# Altium schematic sheet BufferBiasAmp.SchDoc
size A; SheetNumber: 3; SheetTotal: 4
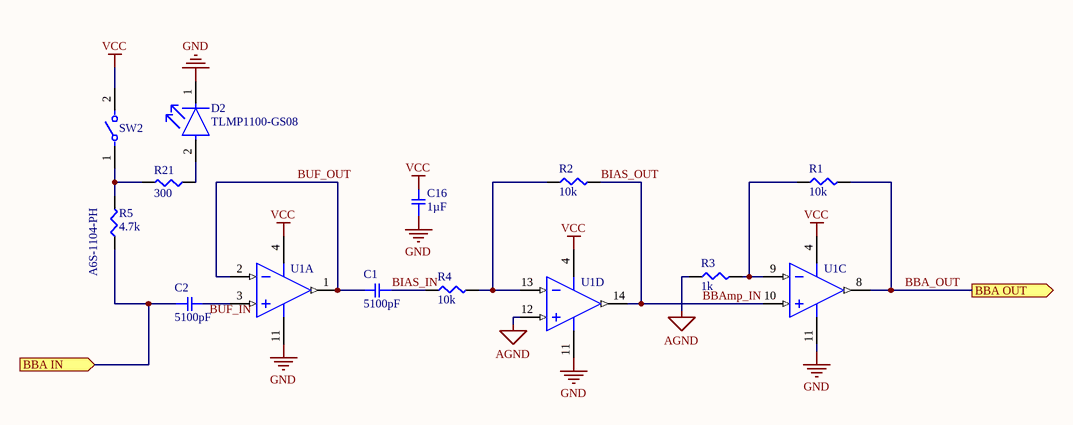
[diagram p0: BufferBiasAmp.SchDoc]

## Parts
C1  5100pF  [SMD-0603C]
C2  5100pF  [SMD-0603C]
C16  1µF  [SMD-0603C]
D2  TLMP1100-GS08  [FP-6_541-5056_01-4-MFG]
R1  10k  [SMD-0603-RES]
R2  10k  [SMD-0603-RES]
R3  1k  [SMD-0603-RES]
R4  10k  [SMD-0603-RES]
R5  4.7k  [SMD-0603-RES]
R21  300  [SMD-0603-RES]
SW2  Switch_Omron_A6S-1104-PH_eec  [Omron_A6S-1104-PH_0]  (value not drawn)
U1  OPA1604AIPWR  [PW0014A_N]  (value not drawn)  (parts A,C,D of 4)

## Ports
BBA IN (in), BBA OUT (out)

## Nets
AGND: R3.1 U1.12(IN_D+)
GND: C16.1 D2.1(C) U1.11(V-)
VCC: C16.2 SW2.2 U1.4(V+)
BBA IN: C2.1 R5.1 ; port BBA IN
BBA_OUT: R1.2 U1.8(OUT_C) ; port BBA OUT
BBAmp_IN: R2.2 U1.10(IN_C+) U1.14(OUT_D)  [also labelled BIAS_OUT]
BIAS_IN: C1.1 R4.1
BUF_OUT: C1.2 U1.1(OUT_A) U1.2(IN_A-)
NetC2_2: C2.2 U1.3(IN_A+)
NetD2_2: D2.2(A) R21.1
NetR1_1: R1.1 R3.2 U1.9(IN_C-)
NetR2_1: R2.1 R4.2 U1.13(IN_D-)
NetR5_2: R5.2 R21.2 SW2.1

## Notes on the sheet
- (near R5) A6S-1104-PH
- Labels drawn without touching a wire or pin: BUF_IN

## Library data of the parts
C1 = GRM1887U1H512JA01D: CAP CER 5100PF 50V U2J 0603; Manufacturer: Murata Electronics North America; Value: 5100pF; Operating Temperature: -55°C ~ 125°C; Package / Case: 0603 (1608 Metric); Datasheet Link: https://www.digikey.com/en/products/detail/murata-electronics/GRM1887U1H512JA01D/2612102; Manufacturer Part Number: GRM1887U1H512JA01D
C2 = GRM1887U1H512JA01D: CAP CER 5100PF 50V U2J 0603; Manufacturer: Murata Electronics North America; Factory Stock: 0; Unit Price (USD): 0.2; Minimum Quantity: 1; Tolerance: ±5%; Datasheets: http://www.murata.com/~/media/webrenewal/support/library/catalog/products/capacitor/mlcc/c02e.pdf; Image: //media.digikey.com/Renders/Murata%20Renders/ZRB-SERIES-0402.jpg; Digi-Key Part Number: 490-6399-1-ND; Part Number: GRM1887U1H512JA01D; Quantity Available: 12288; @ qty: 0; Packaging: Cut Tape (CT); Series: GRM; Part Status: Active; Value: 5100pF; Voltage: 50V; Temperature Coefficient: U2J; Operating Temperature: -55°C ~ 125°C; Features: -; Ratings: -; Applications: General Purpose; Mounting Type: Surface Mount, MLCC; Package / Case: 0603 (1608 Metric); Size / Dimension: 0.063" L x 0.031" W (1.60mm x 0.80mm); Height - Seated (Max): -; Thickness (Max): 0.035" (0.90mm); Lead Spacing: -; Lead Style: -
C16 = GCM188R71C105KA64D: CAP CER 1UF 16V X7R 0603; Manufacturer: Samsung Electro-Mechanics; Manufacturer Part Number: CL10A105KA8NNNC; Value: 1µF; Operating Temperature: -55°C ~ 125°C; Package / Case: 0603 (1608 Metric); Datasheet Link: https://www.digikey.com/en/products/detail/samsung-electro-mechanics/CL10A105KA8NNNC/3886760
D2 = CMP-02520-000009-1: LED GREEN 0603 SMD; Manufacturer: Vishay; Description: Green 561nm LED Indication - Discrete 2.1V 0603 (1608 Metric); Max Junction Temp: +120°C; Automotive Grade: Grade 3; Reverse Voltage: 6V; Led Orientation: Top View; Forward Voltage: 2.1V; Luminous Intensity: 15mcd; Forward Current: 20mA; Colour: Pure green; Peak Emmision Wavelength: 562nm; Wavelength: 561nm; Viewing Angle: 160°; Power Dissipation: 90mW; Digikey Description: LED GREEN 0603 SMD; Package: 6.541-5056.01-4; Ambient Temperature Range High: +100°C; Height: 0.65mm; Device Class L1: Optoelectronics; Device Class L2: LEDs; Mouser Description: Standard LEDs - SMD Pure Green; Temperature Range High: +120°C; RoHS: TRUE; Ambient Temperature Range Low: -40°C; Temperature: to +120°C; Manufacturer Part Number: TLMP1100-GS08; ComponentLink2URL: http://www.vishay.com/docs/83173/tlmb1100.pdf; Lead Free: Yes; Octopart: https://octopart.com/tlmp1100-gs08-vishay-55433993; Automotive: Yes; Device Class L3: unset; ComponentLink2Description: Datasheet; Category: Diode
R1 R2 R4 = ERJ-3EKF1002V: RES SMD 10K OHM 1% 1/10W 0603; Manufacturer: Panasonic Electronic Components; Manufacturer Part Number: RNCP0603FTD10K0; Value: 10k; Operating Temperature: -55°C ~ 155°C; Package / Case: 0603 (1608 Metric); Datasheet Link: https://www.digikey.com/en/products/detail/stackpole-electronics-inc/RNCP0603FTD10K0/2240139
R3 = ERJ-3EKF1001V: RES SMD 1K OHM 1% 1/10W 0603; Manufacturer: Stackpole Electronics Inc; Manufacturer Part Number: RNCP0603FTD1K00; Value: 1k; Operating Temperature: -55°C ~ 155°C; Package / Case: 0603 (1608 Metric); Datasheet Link: https://www.digikey.com/en/products/detail/stackpole-electronics-inc/RNCP0603FTD1K00/2240106
R5 = ERJ-3EKF4701V: RES SMD 4.7K OHM 1% 1/10W 0603; Manufacturer: Panasonic Electronic Components; Value: 4.7k; Operating Temperature: -55°C ~ 155°C; Package / Case: 0603 (1608 Metric); Datasheet Link: https://www.digikey.com/en/products/detail/panasonic-electronic-components/ERJ-3EKF4701V/1746419; Manufacturer Part Number: ERJ-3EKF4701V
R21 = ERJ-3EKF3000V: RES SMD 300 OHM 1% 1/10W 0603; Manufacturer: Panasonic Electronic Components; Value: 300; Operating Temperature: -55°C ~ 155°C; Package / Case: 0603 (1608 Metric); Datasheet Link: https://www.digikey.com/en/products/detail/panasonic-electronic-components/ERJ-3EKF3000V/1746363; Manufacturer Part Number: ERJ-3EKF3000V
SW2 = Switch_Omron_A6S-1104-PH_eec: SWITCH SLIDE DIP SPST 25MA 24V; Manufacturer: Omron; Part Number: A6S-1104-PH; helpURL: https://upverter.com/upn/revision/12a774d2564c312a/; ComponentLink2Description: Datasheet; Temperature: -20°C to +70°C; Package: SMT_SW; Supplier 2: Mouser; Price: 1.25010001648; Supplier 1: Digi-Key; ComponentLink1URL: https://upverter.com/upn/revision/12a774d2564c312a/; Supplier Part Number 2: 653-A6S1104PH; Supplier Part Number 1: A6S-1104-PH-ND; Voltage: 24V; ComponentLink1Description: Upverter; ComponentLink2URL: http://www.omron.com/ecb/products/pdf/en-a6s.pdf; RoHS: TRUE; Mouser Part Number: 653-A6S1104PH; Temperature Range High: +70°C; Digikey Description: SWITCH SLIDE DIP SPST 25MA 24V; Digikey Part Number: A6S-1104-PH-ND; Lead Free: yes; Temperature Range Low: -20°C
U1 = CMP-0272-01731-3: Sound Plus High-Performance, Bipolar-Input Audio Operational Amplifier, 4.5 to 36 V, -40 to 85 degC, 14-pin SOP (PW14), Green (RoHS & no Sb/Br); Manufacturer: Texas Instruments; Datasheet Link: https://www.digikey.com/en/products/detail/texas-instruments/OPA1604AIPWR/2793768; Manufacturer Part Number: OPA1604AIPWR; Operating Temperature: -40°C ~ 85°C; Package / Case: 14-TSSOP